# EAGLE design pcb (EAGLE 9.6.2)
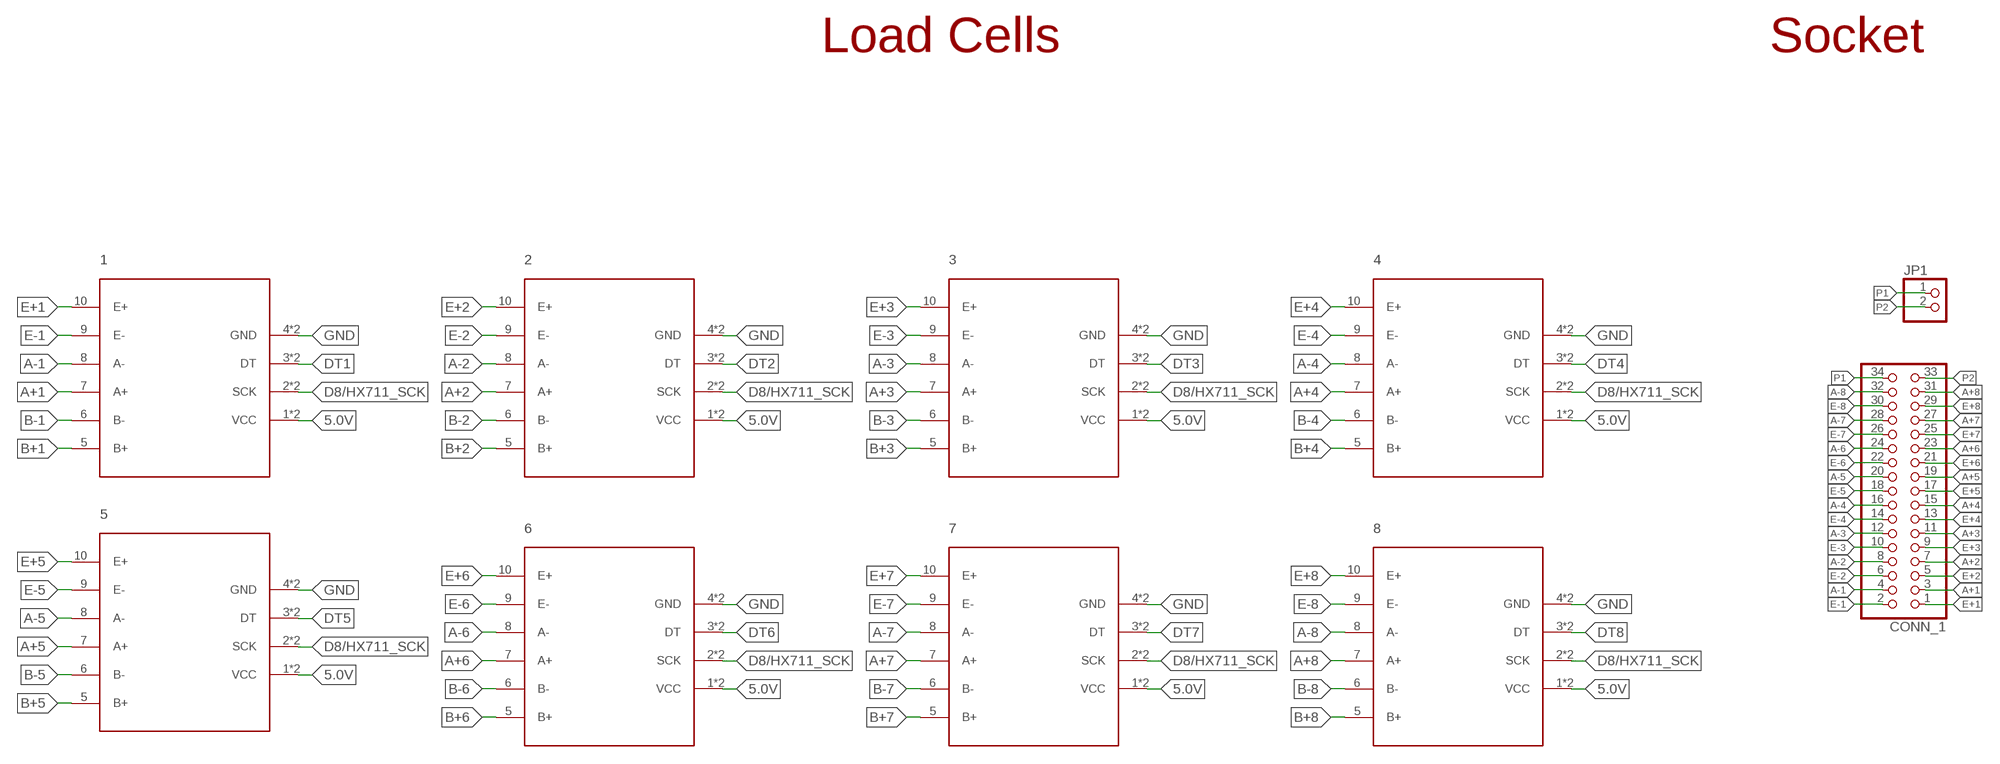
[diagram p0: schematic, sheet 1, part 1 of 2]
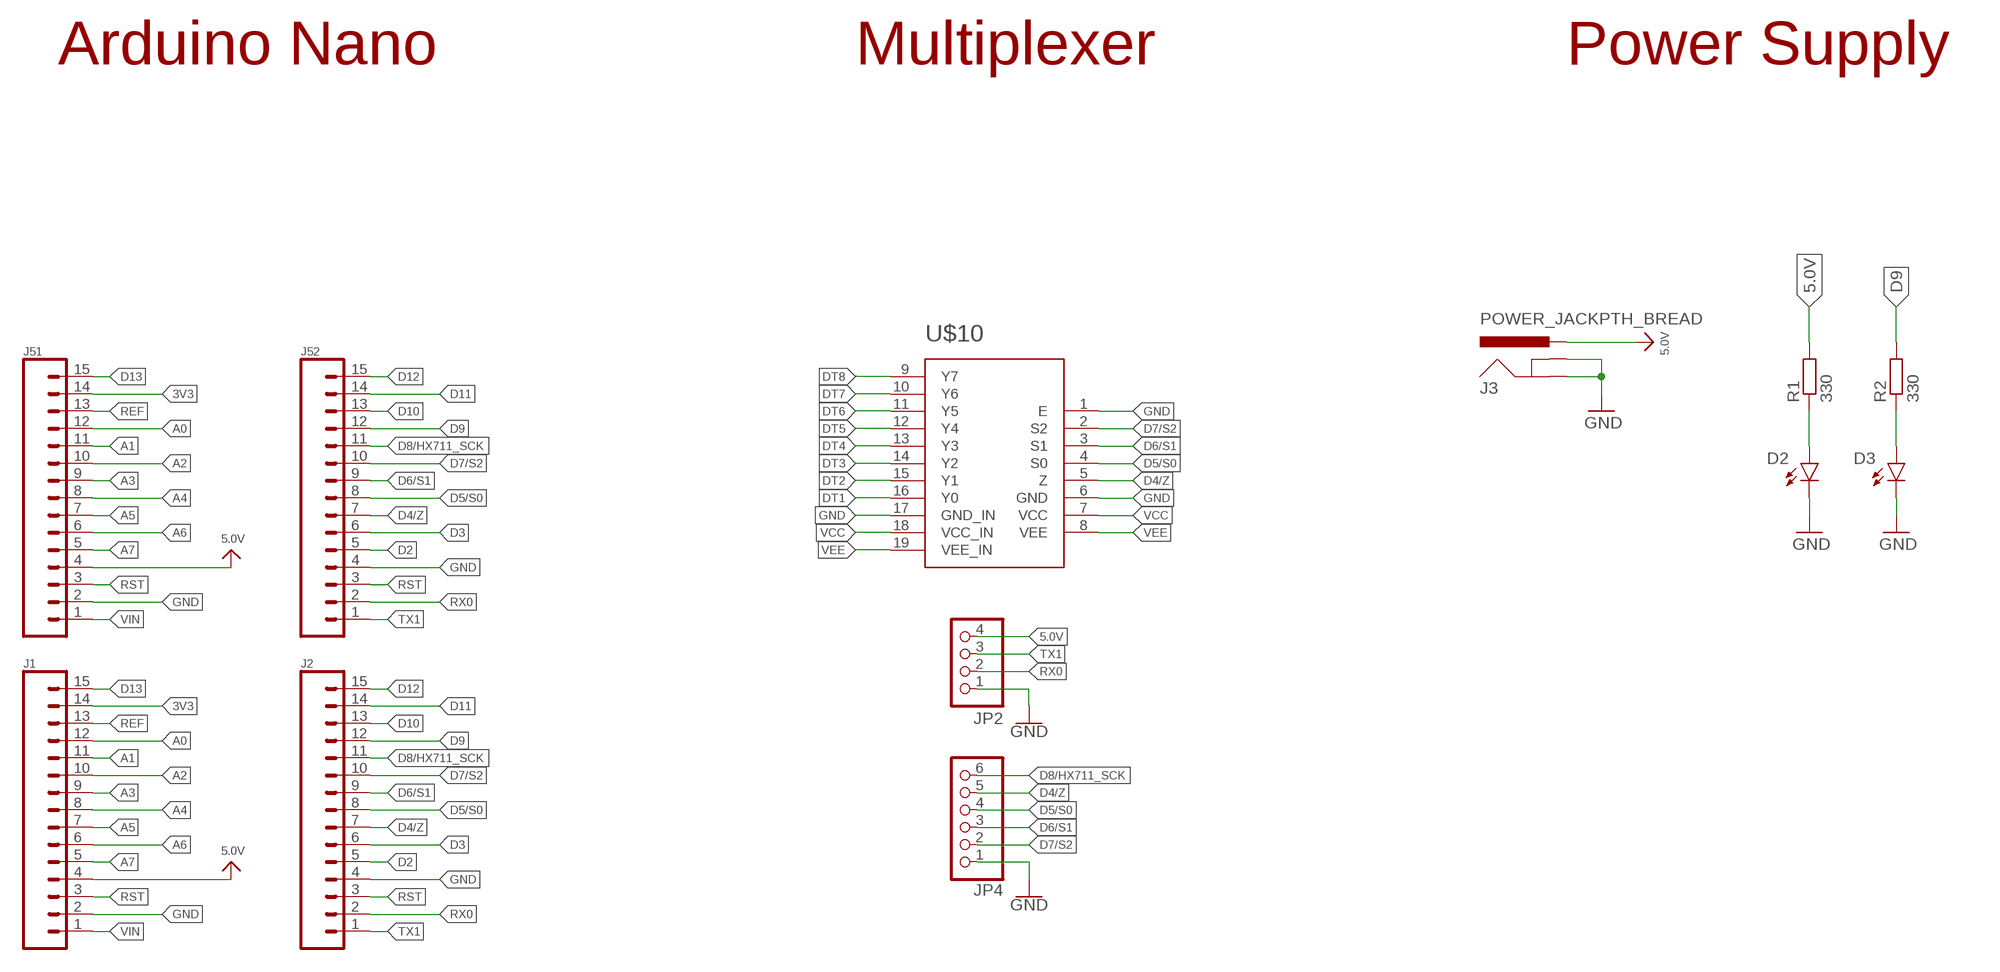
[diagram p1: schematic, sheet 1, part 2 of 2]

## Parts
1  HX711  [HX711]
2  HX711  [HX711]
3  HX711  [HX711]
4  HX711  [HX711]
5  HX711  [HX711]
6  HX711  [HX711]
7  HX711  [HX711]
8  HX711  [HX711]
CONN_1  PINHD-2X17  [2X17]
D2  LED5MM  [LED_5MM]
D3  LED5MM  [LED_5MM]
J1  CONN_15  [1X15]
J2  CONN_15  [1X15]
J3  POWER_JACKPTH_BREAD  [POWER_JACK_PTH_BREAD]
J51  CONN_15  [1X15]
J52  CONN_15  [1X15]
JP1  PINHD-1X2  [1X02]
JP2  PINHD-1X4/90  [1X04/90]
JP4  PINHD-1X6/90  [1X06/90]
R1  330  R-EU_0204/7  [0204/7]
R2  330  R-EU_0204/7  [0204/7]
U$10  8CHMPLEX  [74HC4051]

## Nets
3V3: J1.14 J51.14
5.0V [power_5v]: 1.1(VCC) 1.1.2(VCC) 2.1(VCC) 2.1.2(VCC) 3.1(VCC) 3.1.2(VCC) 4.1(VCC) 4.1.2(VCC) 5.1(VCC) 5.1.2(VCC) 6.1(VCC) 6.1.2(VCC) 7.1(VCC) 7.1.2(VCC) 8.1(VCC) 8.1.2(VCC) J1.4 J3.PWR J51.4 JP2.4 R1.2
A0: J1.12 J51.12
A1: J1.11 J51.11
A2: J1.10 J51.10
A3: J1.9 J51.9
A4: J1.8 J51.8
A5: J1.7 J51.7
A6: J1.6 J51.6
A7: J1.5 J51.5
A+1: 1.7(A+) CONN_1.3
A+2: 2.7(A+) CONN_1.7
A+3: 3.7(A+) CONN_1.11
A+4: 4.7(A+) CONN_1.15
A+5: 5.7(A+) CONN_1.19
A+6: 6.7(A+) CONN_1.23
A+7: 7.7(A+) CONN_1.27
A+8: 8.7(A+) CONN_1.31
A-1: 1.8(A-) CONN_1.4
A-2: 2.8(A-) CONN_1.8
A-3: 3.8(A-) CONN_1.12
A-4: 4.8(A-) CONN_1.16
A-5: 5.8(A-) CONN_1.20
A-6: 6.8(A-) CONN_1.24
A-7: 7.8(A-) CONN_1.28
A-8: 8.8(A-) CONN_1.32
B+1: 1.5(B+)
B+2: 2.5(B+)
B+3: 3.5(B+)
B+4: 4.5(B+)
B+5: 5.5(B+)
B+6: 6.5(B+)
B+7: 7.5(B+)
B+8: 8.5(B+)
B-1: 1.6(B-)
B-2: 2.6(B-)
B-3: 3.6(B-)
B-4: 4.6(B-)
B-5: 5.6(B-)
B-6: 6.6(B-)
B-7: 7.6(B-)
B-8: 8.6(B-)
D2: J2.5 J52.5
D3: J2.6 J52.6
D4/Z: J2.7 J52.7 JP4.5 U$10.5(Z)
D5/S0: J2.8 J52.8 JP4.4 U$10.4(S0)
D6/S1: J2.9 J52.9 JP4.3 U$10.3(S1)
D7/S2: J2.10 J52.10 JP4.2 U$10.2(S2)
D8/HX711_SCK: 1.2(SCK) 1.2.2(SCK) 2.2(SCK) 2.2.2(SCK) 3.2(SCK) 3.2.2(SCK) 4.2(SCK) 4.2.2(SCK) 5.2(SCK) 5.2.2(SCK) 6.2(SCK) 6.2.2(SCK) 7.2(SCK) 7.2.2(SCK) 8.2(SCK) 8.2.2(SCK) J2.11 J52.11 JP4.6
D9: J2.12 J52.12 R2.2
D10: J2.13 J52.13
D11: J2.14 J52.14
D12: J2.15 J52.15
D13: J1.15 J51.15
DT1: 1.3(DT) 1.3.2(DT) U$10.16(Y0)
DT2: 2.3(DT) 2.3.2(DT) U$10.15(Y1)
DT3: 3.3(DT) 3.3.2(DT) U$10.14(Y2)
DT4: 4.3(DT) 4.3.2(DT) U$10.13(Y3)
DT5: 5.3(DT) 5.3.2(DT) U$10.12(Y4)
DT6: 6.3(DT) 6.3.2(DT) U$10.11(Y5)
DT7: 7.3(DT) 7.3.2(DT) U$10.10(Y6)
DT8: 8.3(DT) 8.3.2(DT) U$10.9(Y7)
E+1: 1.10(E+) CONN_1.1
E+2: 2.10(E+) CONN_1.5
E+3: 3.10(E+) CONN_1.9
E+4: 4.10(E+) CONN_1.13
E+5: 5.10(E+) CONN_1.17
E+6: 6.10(E+) CONN_1.21
E+7: 7.10(E+) CONN_1.25
E+8: 8.10(E+) CONN_1.29
E-1: 1.9(E-) CONN_1.2
E-2: 2.9(E-) CONN_1.6
E-3: 3.9(E-) CONN_1.10
E-4: 4.9(E-) CONN_1.14
E-5: 5.9(E-) CONN_1.18
E-6: 6.9(E-) CONN_1.22
E-7: 7.9(E-) CONN_1.26
E-8: 8.9(E-) CONN_1.30
GND: 1.4(GND) 1.4.2(GND) 2.4(GND) 2.4.2(GND) 3.4(GND) 3.4.2(GND) 4.4(GND) 4.4.2(GND) 5.4(GND) 5.4.2(GND) 6.4(GND) 6.4.2(GND) 7.4(GND) 7.4.2(GND) 8.4(GND) 8.4.2(GND) D2.K(C) D3.K(C) J1.2 J2.4 J3.GND J3.GNDBREAK J51.2 J52.4 JP2.1 JP4.1 U$10.1(E) U$10.6(GND) U$10.17(GND_IN)
N$11: D2.A R1.1
N$12: D3.A R2.1
P1: CONN_1.34 JP1.1
P2: CONN_1.33 JP1.2
REF: J1.13 J51.13
RST: J1.3 J2.3 J51.3 J52.3
RX0: J2.2 J52.2 JP2.2
TX1: J2.1 J52.1 JP2.3
VCC: U$10.7(VCC) U$10.18(VCC_IN)
VEE: U$10.8(VEE) U$10.19(VEE_IN)
VIN: J1.1 J51.1

## Notes on the sheet
- Load Cells | Socket | Arduino Nano | Multiplexer | Power Supply

## Library data of the parts
1-8 = loadcell:HX711
CONN_1 = pinhead:PINHD-2X17: PIN HEADER
D2 D3 = SparkFun-LED:LED: LED (Generic) Standard schematic elements and footprints for 5mm, 3mm, 1206, and 0603 sized LEDs. Generic LEDs with no color specified.
J1 J2 J51 J52 = SparkFun-Connectors:CONN_15: Multi connection point. Often used as Generic Header-pin footprint for 0.1 inch spaced/style header connections On any of the 0.1 inch spaced packages, you can populate with these: Break Away Headers - Straight <https://www.sparkfun.com/products/116> (PRT-00116) Break Away Male Headers - Right Angle <https://www.sparkfun.com/products/553> (PRT-00553) Female Headers <https://www.sparkfun.com/products/115> (PRT-00115) Break Away Headers - Machine Pin <https://www.sparkfun.com/products/117> (PRT-00117) Break Away Female Headers - Swiss Machine Pin <https://www.sparkfun.com/products/743> (PRT-00743) For SCREWTERMINALS and SPRING TERMINALS visit here: Screw Terimnals on SparkFun.com <https://www.sparkfun.com/search/results?term=Screw+Terminals> (5mm/3.5mm/2.54mm spacing) This device is also useful as a general connection point to wire up your design to another part of your project. Our various solder wires solder well into these plated through hole pads. Hook-Up Wire - Assortment (Stranded, 22 AWG) <https://www.sparkfun.com/products/11375> (PRT-11375) Hook-Up Wire - Assortment (Solid Core, 22 AWG) <https://www.sparkfun.com/products/11367> (PRT-11367) View the entire wire category on our website here <https://www.sparkfun.com/categories/141> Special notes: Molex polarized connector foot print use with SKU : PRT-08231 with associated crimp pins and housings. 1MM SMD Version SKU: PRT-10208 NOTES ON THE VARIANTS LOCK and LOCK_LONGPADS... This footprint was designed to help hold the alignment of a through-hole component (i.e. 6-pin header) while soldering it into place. You may notice that each hole has been shifted either up or down by 0.005 of an inch from it's more standard position (which is a perfectly straight line). This slight alteration caused the pins (the squares in the middle) to touch the edges of the holes. Because they are alternating, it causes a "brace" to hold the component in place. 0.005 has proven to be the perfect amount of "off-center" position when using our standard breakaway headers. Although looks a little odd when you look at the bare footprint, once you have a header in there, the alteration is very hard to notice. Also,if you push a header all the way into place, it is covered up entirely on the bottom side.; SPICEPREFIX: X
J3 = SparkFun-Connectors:POWER_JACK: Power Jack Connector This is the standard 5.5mm barrel jack for power. The PTH is the most common, proven, reliable, footprint. The Slot footprint only works if the mill layer is transmitted to the PCB fab house so be warned. Here are the connectors we sell at SparkFun: DC Barrel Power Jack/Connector <https://www.sparkfun.com/products/119> (PRT-00119) DC Barrel Power Jack/Connector (SMD) <https://www.sparkfun.com/products/12748> (PRT-12748) DC Barrel Jack Adapter - Breadboard Compatible <https://www.sparkfun.com/products/10811> (PRT-10811) It is used on this SparkFun product (and many, many others): SparkFun RedBoard - Programmed with Arduino <https://www.sparkfun.com/products/12757> (DEV-12757) Also, if you need a mating power supply or connector, please check these out: Wall Adapter Power Supply - 9VDC 650mA <https://www.sparkfun.com/products/298> (TOL-00298) DC Barrel Jack Adapter - Male <https://www.sparkfun.com/products/10287> (PRT-10287); PROD_ID: PRT-10811
JP1 = pinhead:PINHD-1X2: PIN HEADER
JP2 = pinhead:PINHD-1X4: PIN HEADER
JP4 = pinhead:PINHD-1X6: PIN HEADER
R1 R2 = rcl:R-EU_: RESISTOR, European symbol; SPICEPREFIX: R
U$10 = loadcell:8CHMPLEX

## Net classes
0 default: width 0.279 mm, drill 0.35 mm
1 power_5v: width 2.083 mm, drill 1.3 mm
2 power_12v: width 2.083 mm, drill 1.3 mm
3 elmgn: width 2.083 mm, drill 1.3 mm

## Board
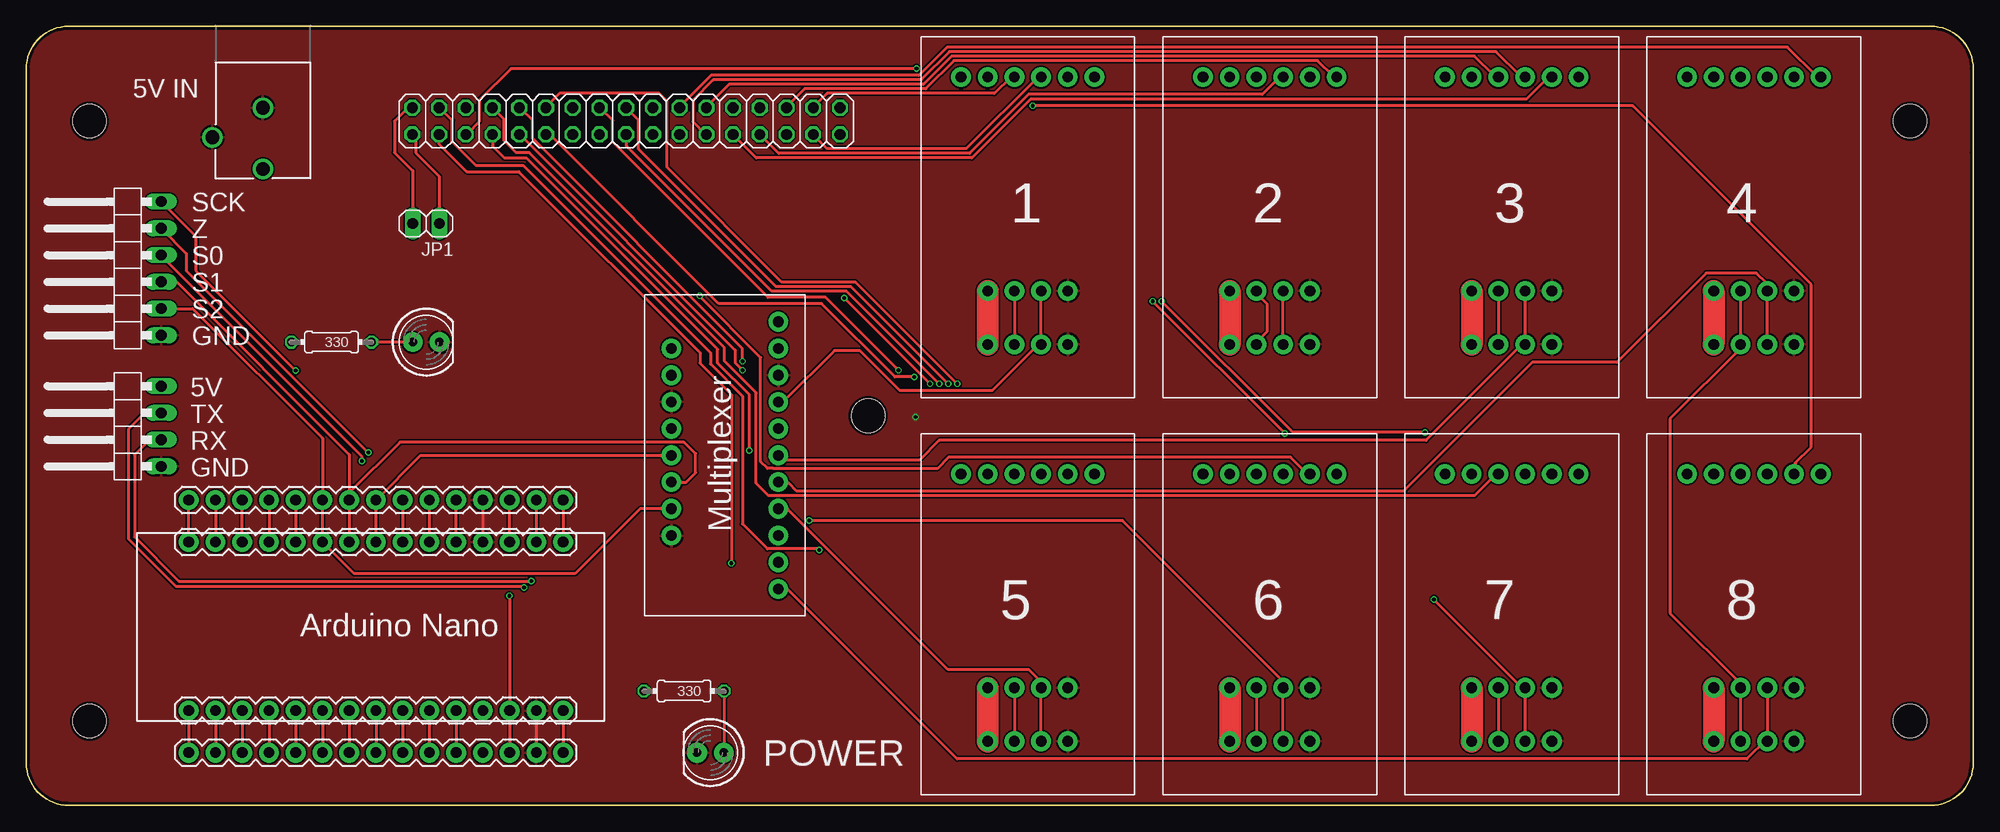
[diagram p2: board, top side]
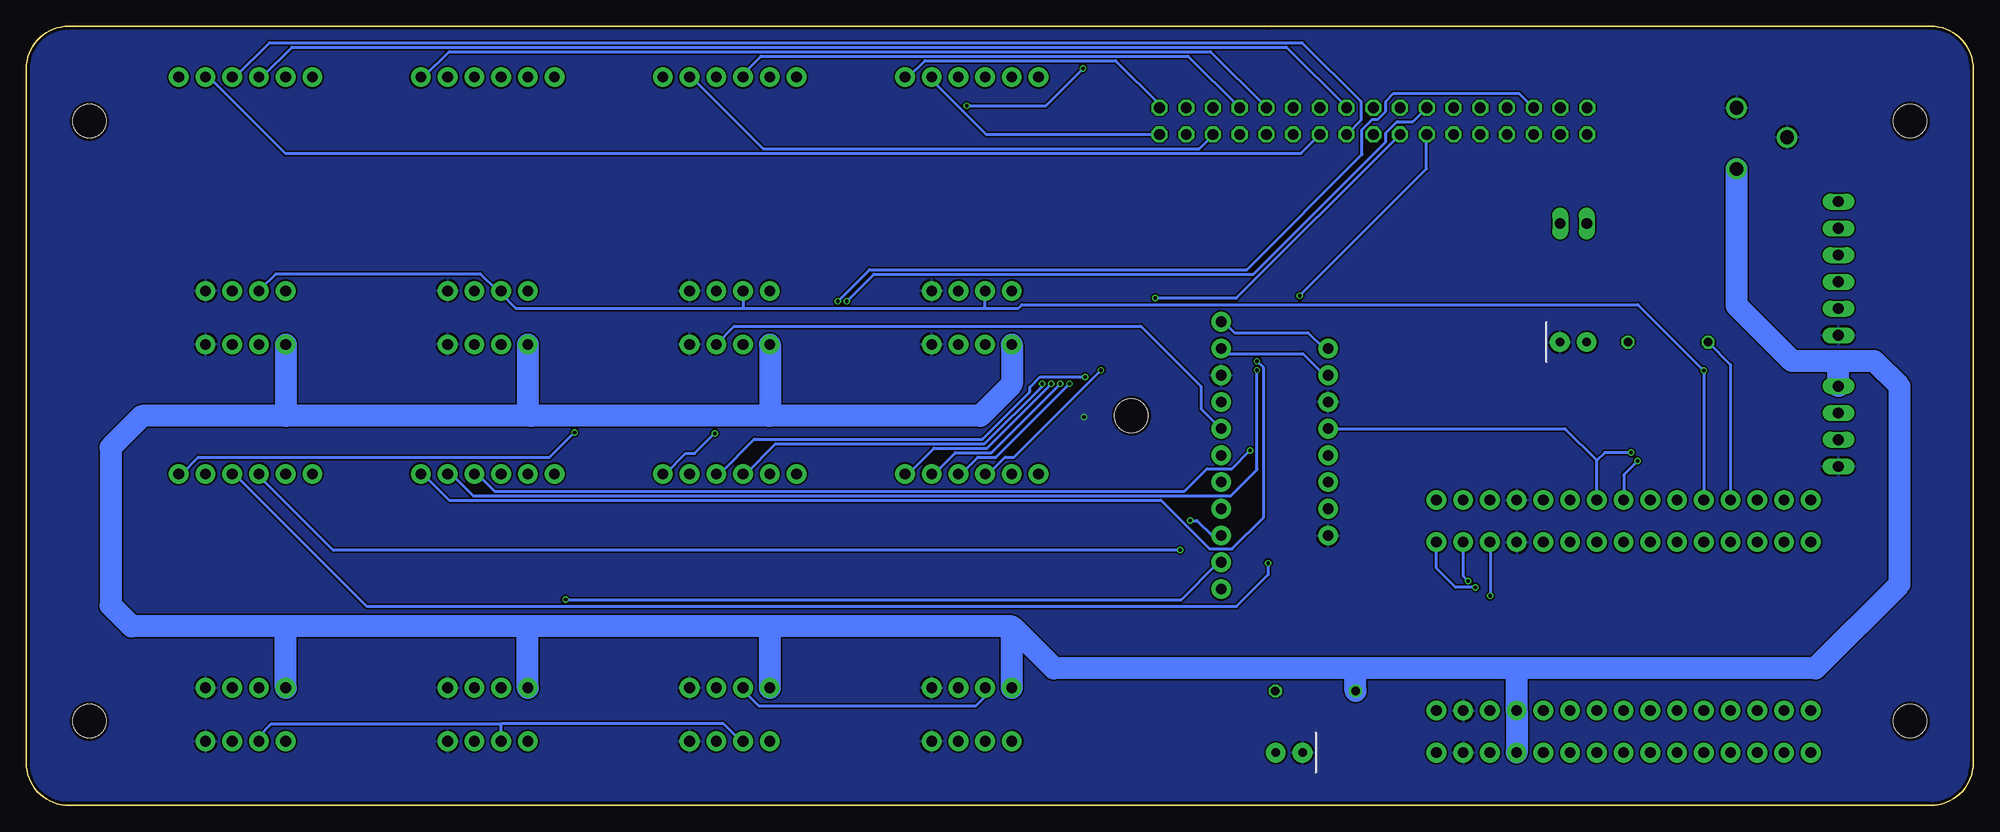
[diagram p3: board, bottom side, seen from below]

Size 185 x 74 mm. Coordinates in mm from the lower left corner, seen from the top.
Outline: 4,74 67,74 180,74 181,74 arc-90 185,70 185,62 185,4 arc-90 181,0 4,0 arc-90 0,4 0,70 arc-90 4,74
Copper layers (1*16): Top 0.018mm / dielectric 1.55mm / Bottom 0.018mm
Design rules "eC_2Layer_PClass6_BaseCopperO18_eCDefault": minimum track width 0.15mm, minimum drill 0.35mm, track to track 0.15mm, track to pad 0.15mm, pad to pad 0.15mm, via to via 0.15mm, smd to smd 0mil, copper to edge 0.25mm, drill to drill 0.35mm, minimum pad ring 0.175mm, minimum via ring 0.125mm, stop-mask expansion 0mil, vias tented up to drill 0.45mm, thermal gap 0.2mm
Holes 3.2 mm at 6,65 179,65 6,8 179,8 80,37

### Footprints (pad centres in the part's own frame; a part is rotated, then mirrored left to right if it is on the bottom)
HX711 = drill 1.016 pad 1.88: 1 6.35,5.08; 1.2 6.35,10.16; 2 8.89,5.08; 2.2 8.89,10.16; 3 11.43,5.08; 3.2 11.43,10.16; 4 13.97,5.08; 4.2 13.97,10.16; 5 3.81,30.48; 6 6.35,30.48; 7 8.89,30.48; 8 11.43,30.48; 9 13.97,30.48; 10 16.51,30.48
2X17 = drill 1.016 octagon: 1 -20.32,-1.27; 2 -20.32,1.27; 3 -17.78,-1.27; 4 -17.78,1.27; 5 -15.24,-1.27; 6 -15.24,1.27; 7 -12.7,-1.27; 8 -12.7,1.27; 9 -10.16,-1.27; 10 -10.16,1.27; 11 -7.62,-1.27; 12 -7.62,1.27; 13 -5.08,-1.27; 14 -5.08,1.27; 15 -2.54,-1.27; 16 -2.54,1.27; 17 0,-1.27; 18 0,1.27; 19 2.54,-1.27; 20 2.54,1.27; 21 5.08,-1.27; 22 5.08,1.27; 23 7.62,-1.27; 24 7.62,1.27; 25 10.16,-1.27; 26 10.16,1.27; 27 12.7,-1.27; 28 12.7,1.27; 29 15.24,-1.27; 30 15.24,1.27; 31 17.78,-1.27; 32 17.78,1.27; 33 20.32,-1.27; 34 20.32,1.27
LED_5MM = drill 0.813 pad 1.88: A -1.27,0; K 1.27,0
1X15 = drill 1.016 pad 1.88: 1 0,0; 2 2.54,0; 3 5.08,0; 4 7.62,0; 5 10.16,0; 6 12.7,0; 7 15.24,0; 8 17.78,0; 9 20.32,0; 10 22.86,0; 11 25.4,0; 12 27.94,0; 13 30.48,0; 14 33.02,0; 15 35.56,0
POWER_JACK_PTH_BREAD = drill 1.3: GND 0,7.9; GNDBREAK 4.8,10.7; PWR 0,13.7
1X02 = drill 1.016 long: 1 -1.27,0; 2 1.27,0
1X04/90 = drill 1.016 long: 1 -3.81,-3.81; 2 -1.27,-3.81; 3 1.27,-3.81; 4 3.81,-3.81
1X06/90 = drill 1.016 long: 1 -6.35,-3.81; 2 -3.81,-3.81; 3 -1.27,-3.81; 4 1.27,-3.81; 5 3.81,-3.81; 6 6.35,-3.81
0204/7 = drill 0.813 octagon: 1 -3.81,0; 2 3.81,0
74HC4051 = drill 1.016 pad 1.88: 1 7.62,12.7; 2 10.16,12.7; 3 12.7,12.7; 4 15.24,12.7; 5 17.78,12.7; 6 20.32,12.7; 7 22.86,12.7; 8 25.4,12.7; 9 2.54,2.54; 10 5.08,2.54; 11 7.62,2.54; 12 10.16,2.54; 13 12.7,2.54; 14 15.24,2.54; 15 17.78,2.54; 16 20.32,2.54; 17 22.86,2.54; 18 25.4,2.54; 19 27.94,2.54

### Placement (x,y rotation side)
1  85,38.7 0 top
2  108,38.7 0 top
3  131,38.7 0 top
4  154,38.7 0 top
5  85,1 0 top
6  108,1 0 top
7  131,1 0 top
8  154,1 0 top
CONN_1  57,65 180 top
D2  65,5 180 top
D3  38,44 0 top
J1  51,5 180 top
J2  51,29 180 top
J3  22.48,74.16 180 top
J51  51,9 180 top
J52  51,25 180 top
JP1  37.98,55.26 180 top
JP2  9,36 90 top
JP4  9,51 90 top
R1  62.5,10.85 180 top
R2  29,44 180 top
U$10  74,18 90 top

### Tracks (layer width: path | path; a pad name or v marks a point on that pad's centre or on a via)
3V3
  Top 0.279: J51.14 J1.14
5.0V
  Top 2.083: 8.1.2 8.1 | 6.1.2 6.1 | 1.1.2 1.1 | 3.1.2 3.1 | 5.1.2 5.1 | 7.1.2 7.1 | 2.1.2 2.1 | 4.1.2 4.1
  Bottom 2.083: 114.4,37 94.35,37 91.35,40 1.1 | 114.4,37 137,37 | 137,37 160.35,37 | 160.35,37 174,37 177,34 177,19 175,17 160.35,17 | 91.35,17 114.35,17 | 114.35,17 137.35,17 | 137.35,17 160.35,17 | 58.69,13 87.35,13 91.35,17 | R1.2 58.69,13 | J1.4 J51.4 43.38,12.62 43,13 | J3.PWR 22.5,60.44 22.5,47.5 17.2,42.2 13.1,42.2 | 43,13 15,13 7,21 7,39.8 9.4,42.2 13.1,42.2 | 43,13 58.69,13 | 2.1 114.35,37.05 114.4,37 | 3.1 137.35,37.35 137,37 | 4.1 160.35,37 | 8.1.2 160.35,17 | 7.1.2 137.35,17 | 6.1.2 114.35,17 | 5.1.2 91.35,17 | JP2.4 12.81,41.91 13.1,42.2
A0
  Top 0.279: J51.12 J1.12
A1
  Top 0.279: J51.11 J1.11
A2
  Top 0.279: J51.10 J1.10
A3
  Top 0.279: J51.9 J1.9
A4
  Top 0.279: J51.8 J1.8
A5
  Top 0.279: J51.7 J1.7
A6
  Top 0.279: J51.6 J1.6
A7
  Top 0.279: J51.5 J1.5
A+1
  Top 0.279: CONN_1.3 74.82,66.34 76.11,67.63 92,67.63 93.5,69.13 93.82,69.13 1.7
A+2
  Bottom 0.279: CONN_1.7 69.78,66.34 74.61,71.17 115.19,71.17 116.8,69.56 116.8,69.24 2.7
A+3
  Top 0.279: CONN_1.11 64.62,66.34 66.77,68.49 85.24,68.49 87.92,71.17 137.62,71.17 139.56,69.24 139.88,69.24 3.7
A+4
  Bottom 0.279: CONN_1.15 59.58,66.34 65.27,72.03 159.74,72.03 162.53,69.24 162.85,69.24 4.7
A+5  (via drill 0.35)
  Top 0.279: v82.87,41.33 75.95,48.26 70.47,48.26 55.72,63.01 55.72,65.05 54.53,66.23 CONN_1.19
  Bottom 0.279: v82.87,41.33 91.14,33.06 92,33.06 93.5,31.56 93.82,31.56 5.7
A+6  (via drill 0.35)
  Top 0.279: v88.46,40.04 78.8,49.7 71.78,49.7 60.87,60.61 60.87,66.88 60.12,67.63 50.67,67.63 49.38,66.34 CONN_1.23
  Bottom 0.279: v88.46,40.04 88.46,39.83 93.93,34.35 113.79,34.35 116.58,31.56 116.8,31.56 6.7
A+7
  Top 0.279: CONN_1.27 44.34,66.23 45.41,65.16 45.41,63.12 46.53,62 47.8,62 66.33,43.47 66.33,42.2 69.35,39.18 69.35,30.59 70.53,29.41 137.62,29.41 139.66,31.45 139.88,31.45 7.7
A+8  (via drill 0.35)
  Top 0.279: v75.36,24.26 75.25,24.37 70.42,24.37 68.06,26.73 68.06,38.86 65,41.92 65,43 47.22,60.78 42.71,60.78 40.47,63.01 40.47,65.05 39.29,66.23 CONN_1.31
  Bottom 0.279: v75.36,24.26 155.87,24.26 162.85,31.24 162.85,31.45 8.7
A-1
  Top 0.279: CONN_1.4 74.82,63.66 76.11,62.37 89.31,62.37 96.08,69.13 96.4,69.13 1.8
A-2
  Top 0.279: CONN_1.8 69.78,63.66 71.5,61.94 89.64,61.94 95.22,67.52 117.44,67.52 119.05,69.13 119.37,69.13 2.8
A-3
  Top 0.279: CONN_1.12 64.52,63.77 63.34,64.95 63.34,66.99 65.27,68.92 85.02,68.92 87.7,71.6 139.66,71.6 142.02,69.24 142.35,69.24 3.8
A-4
  Bottom 0.279: CONN_1.16 59.47,63.77 58.18,65.05 58.18,66.88 63.77,72.46 161.88,72.46 165.1,69.24 165.43,69.24 4.8
A-5  (via drill 0.35)
  Top 0.279: v85.88,40.04 v77.72,48.2
  Bottom 0.279: v77.72,48.2 69.99,48.2 54.53,63.66 CONN_1.20 | v85.88,40.04 92.86,33.06 94.58,33.06 96.08,31.56 96.4,31.56 5.8
A-6  (via drill 0.35)
  Top 0.279: CONN_1.24 49.71,63.73 65.78,47.66 75.57,47.66 82.54,40.69 v84.38,40.69
  Bottom 0.279: v84.38,40.69 88.67,40.69 89.64,39.72 89.64,39.29 94.15,34.78 115.83,34.78 119.05,31.56 119.37,31.56 6.8
A-7  (via drill 0.35)
  Top 0.279: v68.7,33.71 68.7,39 65.7,42 65.7,43.3 47.53,61.47 45.45,61.47 44.3,62.62 CONN_1.28
  Bottom 0.279: v68.7,33.71 70.42,31.99 72.8,31.99 74.94,29.84 140.52,29.84 142.13,31.45 142.35,31.45 7.8
A-8  (via drill 0.35)
  Top 0.279: CONN_1.32 39.18,63.66 39.18,62.87 41.85,60.2 46.8,60.2 64,43 64,42 67,39 v67,23
  Bottom 0.279: 8.8 165.43,31.45 165.21,31.45 152.65,18.89 70,18.89 67,21.89 v67,23
D2
  Top 0.279: J52.5 J2.5
D3
  Top 0.279: J2.6 J52.6
D4/Z  (via drill 0.35)
  Top 0.279: J2.7 J52.7 | JP4.5 15.21,52.41 15.21,50.79 v32.5,33.5
  Bottom 0.279: J2.7 35.76,32.76 | U$10.5 38.78,35.78 35.76,32.76 | 35.76,32.76 35.02,33.5 v32.5,33.5
D5/S0  (via drill 0.35)
  Top 0.279: J52.8 J2.8 37.46,33.24 U$10.4 | JP4.4 12.81,52.19 31.9,33.1 v31.9,32.7
  Bottom 0.279: v31.9,32.7 33.22,31.38 J2.8
D6/S1
  Top 0.279: J52.9 J2.9 30.68,29.68 | U$10.3 62.7,30.7 63.6,31.6 63.6,33.4 62.5,34.5 35.5,34.5 30.68,29.68 | JP4.3 14.27,49.73 30.68,33.32 30.68,29.68
D7/S2
  Top 0.279: U$10.2 58.3,28.16 52.14,22 31.14,22 J52.10 J2.10 28.14,34.86 15.81,47.19 JP4.2
D8/HX711_SCK  (via drill 0.35)
  Top 0.279: J2.11 J52.11 | 6.2.2 6.2 | 8.2 8.2.2 162.85,11.27 162.85,11.59 156.19,18.25 156.19,36.71 162.85,43.37 162.85,43.69 4.2 4.2.2 | 1.2.2 1.2 | 3.2.2 3.2 | 5.2.2 5.2 | 7.2.2 7.2 | JP4.6 16.11,54.05 16.11,50.79 v25.6,41.3 | 2.2 116.9,43.8 116.9,44.01 117.87,44.98 117.87,47.66 116.9,48.63 116.9,48.84 2.2.2
  Bottom 0.279: J2.11 v25.6,41.3 31.86,47.56 90.39,47.56 90.71,47.23 93.89,47.23 | 139.9,7.73 161.74,7.73 162.89,6.58 8.2 | 5.2.2 93.89,10.32 94.76,9.45 115.4,9.45 116.8,10.84 116.8,11.06 6.2.2 | 6.2 116.9,6.12 117.12,6.12 118.73,7.73 139.9,7.73 | 4.2.2 162.85,48.95 162.83,48.95 161.32,50.45 141.81,50.45 140.31,48.95 139.98,48.95 3.2.2 139.89,48.64 138.48,47.23 116.9,47.23 | 2.2.2 116.89,47.24 116.9,47.23 | 93.89,47.23 1.2.2 | 116.9,47.23 93.89,47.23 | 7.2 139.89,7.72 139.9,7.73
D9
  Top 0.279: J2.12 J52.12
  Bottom 0.279: R2.2 23.06,41.87 J2.12
D10
  Top 0.279: J52.13 J2.13
D11
  Top 0.279: J2.14 J52.14
D12
  Top 0.279: J52.15 J2.15
D13
  Top 0.279: J51.15 J1.15
DT1
  Top 0.279: 1.3.2 1.3 96.29,43.91 91.78,39.4 83,39.4 79.2,43.2 76.8,43.2 71.92,38.32 71.5,38.32 U$10.16
DT2
  Top 0.279: 2.3 2.3.2
  Bottom 0.279: U$10.15 73.36,37.68 73.36,39.79 79.09,45.52 117.73,45.52 119.43,43.82 2.3
DT3
  Top 0.279: 3.3.2 3.3 142.35,43.69 142.02,43.69 133.01,34.67 86.75,34.67 84.85,32.78 71.92,32.78 U$10.14
DT4
  Top 0.279: 4.3 4.3.2 165.43,49.53 164.39,50.56 159.63,50.56 151.15,42.08 143.1,42.08 130.86,29.84 73.21,29.84 72.46,30.59 71.5,30.59 U$10.13
DT5
  Top 0.279: 5.3 5.3.2 96.43,11.72 95.27,12.88 87.6,12.88 72.35,28.13 71.5,28.13 U$10.12
DT6  (via drill 0.35)
  Top 0.279: 6.3 6.3.2 119.43,11.79 104.17,27.05 v74.39,27.05
  Bottom 0.279: v74.39,27.05 73.75,27.05 72.35,25.66 71.5,25.66 U$10.11
DT7  (via drill 0.35)
  Top 0.279: 7.3 7.3.2 142.35,11.27 142.02,11.27 v133.76,19.54
  Bottom 0.279: v133.76,19.54 75.25,19.54 71.82,22.97 71.5,22.97 U$10.10
DT8
  Top 0.279: 8.3.2 8.3 165.32,6.23 163.49,4.4 88.46,4.4 72.35,20.5 71.5,20.5 U$10.9
E+1
  Bottom 0.279: CONN_1.1 77.32,66.58 81.48,70.74 99.62,70.74 101.12,69.24 101.45,69.24 1.10
E+2
  Top 0.279: CONN_1.5 72.25,66.34 73.96,68.06 85.45,68.06 88.13,70.74 122.7,70.74 124.2,69.24 124.42,69.24 2.10
E+3
  Bottom 0.279: CONN_1.9 67.2,66.34 72.46,71.6 144.81,71.6 147.18,69.24 147.5,69.24 3.10
E+4
  Top 0.279: CONN_1.13 62.08,66.37 65.05,69.35 84.81,69.35 87.49,72.03 167.36,72.03 170.15,69.24 170.47,69.24 4.10
E+5  (via drill 0.35)
  Top 0.279: v87.6,40.04 78.36,49.27 71.23,49.27 58.18,62.32 58.18,65.05 57,66.23 CONN_1.17
  Bottom 0.279: v87.6,40.04 93.72,33.92 98.76,33.92 101.12,31.56 101.45,31.56 5.10
E+6  (via drill 0.35)
  Top 0.279: v119.59,35.32 v107.03,47.88
  Bottom 0.279: v107.03,47.88 104.45,50.45 68.38,50.45 55.82,63.01 55.82,63.87 54.75,64.95 53.25,64.95 51.96,66.23 CONN_1.21 | v119.59,35.32 121.49,33.42 122.35,33.42 124.2,31.56 124.42,31.56 6.10
E+7  (via drill 0.35)
  Top 0.279: v68.06,42.19 68.06,43.39 48.09,63.36 48.09,65.05 46.91,66.23 CONN_1.25
  Bottom 0.279: v68.06,42.19 67.42,41.54 67.42,27.37 70.42,24.37 72.57,24.37 77.19,28.98 144.81,28.98 147.28,31.45 147.5,31.45 7.10
E+8  (via drill 0.35)
  Top 0.279: v107.89,47.88 120.34,35.42 v132.9,35.42
  Bottom 0.279: v107.89,47.88 104.88,50.88 69.02,50.88 58.08,61.83 58.08,64.19 57.11,65.16 56.57,65.16 55.82,65.91 55.82,66.88 55.07,67.63 43.16,67.63 41.87,66.34 CONN_1.29 | v132.9,35.42 135.26,33.06 168.65,33.06 170.15,31.56 170.47,31.56 8.10
E-1
  Bottom 0.279: CONN_1.2 77.4,63.77 93.82,63.77 98.87,68.81 98.87,69.13 1.9
E-2
  Bottom 0.279: CONN_1.6 72.25,63.66 73.53,62.37 114.97,62.37 121.73,69.13 121.95,69.13 2.9
E-3
  Top 0.279: CONN_1.10 67.2,63.66 69.35,61.51 89.85,61.51 95.43,67.09 142.56,67.09 144.6,69.13 144.92,69.13 3.9
E-4
  Bottom 0.279: CONN_1.14 62.16,63.66 63.87,61.94 160.38,61.94 167.57,69.13 167.9,69.13 4.9
E-5  (via drill 0.35)
  Top 0.279: v86.74,40.04 77.94,48.84 70.82,48.84 57.04,62.62 CONN_1.18
  Bottom 0.279: v86.74,40.04 93.29,33.49 96.72,33.49 98.66,31.56 98.87,31.56 5.9
E-6  (via drill 0.35)
  Top 0.279: v64.01,48.4 64.01,48.3 69.78,42.53 69.78,32.63 70.41,32 70.95,32 70.96,31.99 86.57,31.99 87.64,33.06 120.12,33.06 121.63,31.56 121.95,31.56 6.9
  Bottom 0.279: v64.01,48.4 51.96,60.45 51.96,63.66 CONN_1.22
E-7  (via drill 0.35)
  Top 0.279: v68.06,41.33 67.36,42.03 67.36,43.23 46.86,63.73 CONN_1.26
  Bottom 0.279: v68.06,41.33 68.06,31.88 70.53,29.41 142.56,29.41 144.6,31.45 144.92,31.45 7.9
E-8  (via drill 0.35)
  Top 0.279: v84.59,69.99 46.05,69.99 43.05,66.99 43.05,64.95 41.87,63.77 CONN_1.30 | v95.65,66.45 152.65,66.45 169.61,49.49 169.61,34.03 168.11,32.53 168.11,32.42 168,32.31 168,31.56 8.9
  Bottom 0.279: v84.59,69.99 84.59,69.97 88.11,66.45 v95.65,66.45
GND  (via drill 0.35)
  Top 0.279: J51.2 J1.2 | J2.4 J52.4
  other vias: 84.5,36.9
  pour Bottom: -2,-2 187,-2 187,76 -2,76
  pour Top: -3,-3 186,-3 186,75 -3,75
N$11
  Top 0.279: R1.1 66.31,5.04 D2.A
N$12
  Top 0.279: D3.A R2.1
P1
  Top 0.279: CONN_1.34 37,63.41 37,62 39.25,59.75 JP1.1
P2
  Top 0.279: CONN_1.33 36.27,66.27 35,65 35,62 36.71,60.29 JP1.2
REF
  Top 0.279: J51.13 J1.13
RST  (via drill 0.35)
  Top 0.279: J1.3 J51.3 45.92,19.88 v45.9,19.9 | J52.3 J2.3
  Bottom 0.279: v45.9,19.9 45.9,25 J52.3
RX0  (via drill 0.35)
  Top 0.279: J2.2 J52.2 | JP2.2 11.73,34.73 10.3,33.3 10.3,25.5 14.5,21.3 v48,21.3
  Bottom 0.279: v48,21.3 48.46,21.76 J52.2
TX1  (via drill 0.35)
  Top 0.279: J2.1 J52.1 | JP2.3 11.27,37.27 9.7,35.7 9.7,25.3 14.2,20.8 47.2,20.8 v47.3,20.7
  Bottom 0.279: v47.3,20.7 49.2,20.7 51,22.5 J52.1
VCC
  Bottom 0.279: U$10.18 71.46,43.26 71.1,42.9 63.7,42.9 61.7,40.9 61.3,40.9 U$10.7
VEE
  Bottom 0.279: U$10.8 61.7,43.4 63.2,44.9 70.2,44.9 71.2,45.9 71.4,45.9 U$10.19
VIN
  Top 0.279: J51.1 J1.1

### Text on the board
tPlace: 5V IN | SCK | Z | S0 | S1 | S2 | GND | 5V | TX | RX | GND | Multiplexer | Arduino Nano | POWER